# Altium project O_Flicker_V01_D0506.PrjPCB
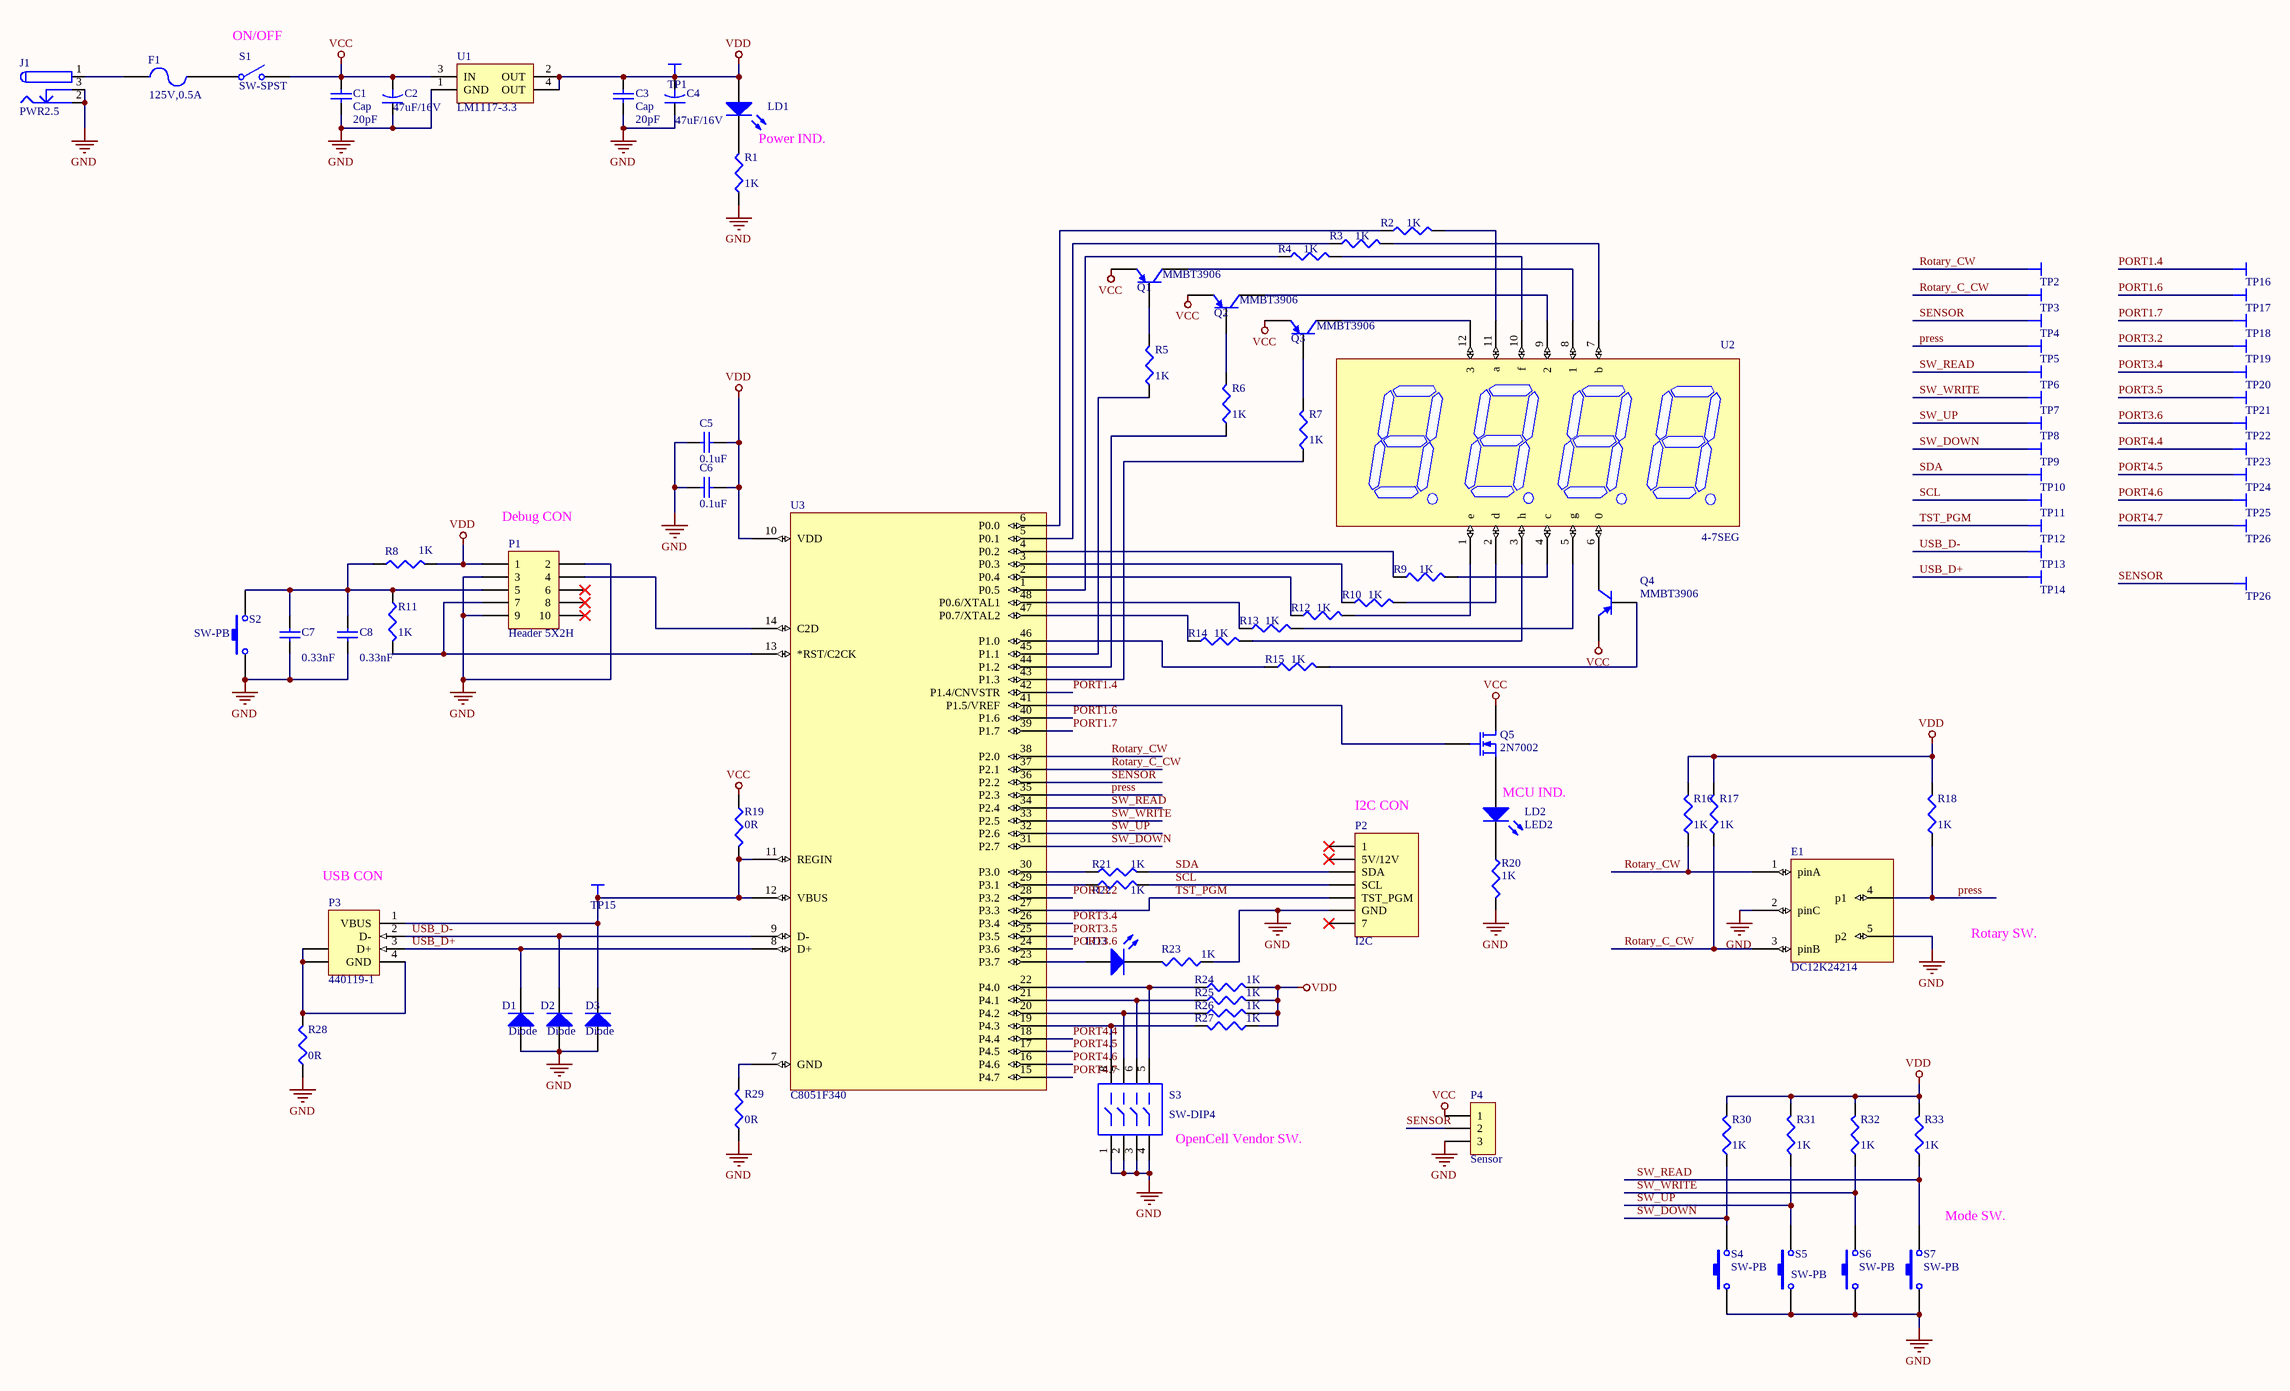
[diagram p0: Flicker_hardwareV01_D0506.SchDoc]
1 sheet, 96 parts. Net scope: global (net labels, ports and power ports of the same name join across sheets).
Board file: O_Flicker_V01_D0506.PcbDoc

## Sheet Flicker_hardwareV01_D0506.SchDoc
size A2

### Parts
(Parts that share a designator on the sheet are numbered #1, #2 ... from top to bottom, then left to right.)
C1  Cap  value 20pF  [C0805]
C2  47uF/16V  [CAP-5*2]
C3  Cap  value 20pF  [C0805]
C4  47uF/16V  [CAP-5*2]
C5  value 0.1uF  [C0603]  (hidden comment: Cap Semi)
C6  value 0.1uF  [C0603]  (hidden comment: Cap Semi)
C7  value 0.33nF  [C0603]  (hidden comment: Cap Semi)
C8  value 0.33nF  [C0603]  (hidden comment: Cap Semi)
D1  Diode  [DO-214AA]
D2  Diode  [DO-214AA]
D3  Diode  [DO-214AA]
E1  DC12K24214  [DC12K24214]
F1  Fuse 2  [F1206]  (value not drawn)
J1  value PWR2.5  [DC-JACK]  (hidden comment: DC JACK 3P/2mm)
LD1  LED2  [D0603]  (value not drawn)
LD2  LED2  [D0603]
LD3  LED2  [D0603]  (value not drawn)
P1  Header 5X2H  [HDR2X5]
P2  I2C  [CH7P\2.0-H]
P3  440119-1  [440119]
P4  Sensor  [CH3P\2.54-V]
Q1  MMBT3906  [SOT23_N]
Q2  MMBT3906  [SOT23_N]
Q3  MMBT3906  [SOT23_N]
Q4  MMBT3906  [SOT23_N]
Q5  2N7002  [SOT23_N]
R1  value 1K  [R0603]  (hidden comment: Res3)
R2  value 1K  [R0603]  (hidden comment: Res3)
R3  value 1K  [R0603]  (hidden comment: Res3)
R4  value 1K  [R0603]  (hidden comment: Res3)
R5  value 1K  [R0603]  (hidden comment: Res3)
R6  value 1K  [R0603]  (hidden comment: Res3)
R7  value 1K  [R0603]  (hidden comment: Res3)
R8  value 1K  [R0603]  (hidden comment: Res3)
R9  value 1K  [R0603]  (hidden comment: Res3)
R10  value 1K  [R0603]  (hidden comment: Res3)
R11  value 1K  [R0603]  (hidden comment: Res3)
R12  value 1K  [R0603]  (hidden comment: Res3)
R13  value 1K  [R0603]  (hidden comment: Res3)
R14  value 1K  [R0603]  (hidden comment: Res3)
R15  value 1K  [R0603]  (hidden comment: Res3)
R16  value 1K  [R0603]  (hidden comment: Res3)
R17  value 1K  [R0603]  (hidden comment: Res3)
R18  value 1K  [R0603]  (hidden comment: Res3)
R19  value 0R  [R0603]  (hidden comment: Res3)
R20  value 1K  [R0603]  (hidden comment: Res3)
R21  value 1K  [R0603]  (hidden comment: Res3)
R22  value 1K  [R0603]  (hidden comment: Res3)
R23  value 1K  [R0603]  (hidden comment: Res3)
R24  value 1K  [R0603]  (hidden comment: Res3)
R25  value 1K  [R0603]  (hidden comment: Res3)
R26  value 1K  [R0603]  (hidden comment: Res3)
R27  value 1K  [R0603]  (hidden comment: Res3)
R28  value 0R  [R0603]  (hidden comment: Res3)
R29  value 0R  [R0603]  (hidden comment: Res3)
R30  value 1K  [R0603]  (hidden comment: Res3)
R31  value 1K  [R0603]  (hidden comment: Res3)
R32  value 1K  [R0603]  (hidden comment: Res3)
R33  value 1K  [R0603]  (hidden comment: Res3)
S1  SW-SPST  [SW-2P]
S2  SW-PB  [SW-DIP4P-1]
S3  SW-DIP4  [SW-8P\11.52*9.9]
S4  SW-PB  [SW-DIP4P-1]
S5  SW-PB  [SW-DIP4P-1]
S6  SW-PB  [SW-DIP4P-1]
S7  SW-PB  [SW-DIP4P-1]
TP1  TP  [TP30]  (value not drawn)
TP2  TP  [TP30]  (value not drawn)
TP3  TP  [TP30]  (value not drawn)
TP4  TP  [TP30]  (value not drawn)
TP5  TP  [TP30]  (value not drawn)
TP6  TP  [TP30]  (value not drawn)
TP7  TP  [TP30]  (value not drawn)
TP8  TP  [TP30]  (value not drawn)
TP9  TP  [TP30]  (value not drawn)
TP10  TP  [TP30]  (value not drawn)
TP11  TP  [TP30]  (value not drawn)
TP12  TP  [TP30]  (value not drawn)
TP13  TP  [TP30]  (value not drawn)
TP14  TP  [TP30]  (value not drawn)
TP15  TP  [TP30]  (value not drawn)
TP16  TP  [TP1]  (value not drawn)
TP17  TP  [TP1]  (value not drawn)
TP18  TP  [TP1]  (value not drawn)
TP19  TP  [TP1]  (value not drawn)
TP20  TP  [TP1]  (value not drawn)
TP21  TP  [TP1]  (value not drawn)
TP22  TP  [TP1]  (value not drawn)
TP23  TP  [TP1]  (value not drawn)
TP24  TP  [TP1]  (value not drawn)
TP25  TP  [TP1]  (value not drawn)
TP26#1  TP  [TP1]  (value not drawn)
TP26#2  TP  [TP1]  (value not drawn)
U1  LM1117-3.3  [ZZ311]
U2  4-7SEG
U3  C8051F340  [TQFP-48]

### Nets
GND: C1.1 C2.1 C3.1 C4.1 C5.2 C6.2 C7.1 C8.1 D1.1(A) D2.1(A) D3.1(A) E1.2(pinC) E1.5(p2) J1.2 J1.3 P1.2 P1.3 P1.9 P2.6(GND) P4.3 R1.1 R20.2 R23.1 R28.1 R29.1 S2.2 S3.1 S3.2 S3.3 S3.4 S4.1 S5.1 S6.1 S7.1 U1.1(GND)
VCC: C1.2 C2.2 P4.1 Q1.2(E) Q2.2(E) Q3.2(E) Q4.2(E) Q5.1(D) R19.1 S1.2(NO) U1.3(IN)
VDD: C3.2 C4.2 C5.1 C6.1 LD1.1(A) P1.1 R8.2 R16.2 R17.2 R18.2 R24.2 R25.2 R26.2 R27.1 R30.2 R31.2 R32.2 R33.2 TP1.1(TP?) U1.2(OUT) U1.4(OUT) U3.10(VDD)
PORT1.4: TP16.1(TP?) U3.42(P1.4/CNVSTR)
PORT1.6: TP17.1(TP?) U3.40(P1.6)
PORT1.7: TP18.1(TP?) U3.39(P1.7)
PORT3.2: TP19.1(TP?) U3.28(P3.2)
PORT3.4: TP20.1(TP?) U3.26(P3.4)
PORT3.5: TP21.1(TP?) U3.25(P3.5)
PORT3.6: TP22.1(TP?) U3.24(P3.6)
PORT4.4: TP23.1(TP?) U3.18(P4.4)
PORT4.5: TP24.1(TP?) U3.17(P4.5)
PORT4.6: TP25.1(TP?) U3.16(P4.6)
PORT4.7: TP26#1.1(TP?) U3.15(P4.7)
press: E1.4(p1) R18.1 TP5.1(TP?) U3.35(P2.3)
Rotary_C_CW: E1.3(pinB) R17.1 TP3.1(TP?) U3.37(P2.1)
Rotary_CW: E1.1(pinA) R16.1 TP2.1(TP?) U3.38(P2.0)
SCL: P2.4(SCL) R22.2 TP11.1(TP?)
SDA: P2.3(SDA) R21.2 TP10.1(TP?)
SENSOR: P4.2 TP4.1(TP?) TP26#2.1(TP?) U3.36(P2.2)
SW_DOWN: R30.1 S4.2 TP9.1(TP?) U3.31(P2.7)
SW_READ: R33.1 S7.2 TP6.1(TP?) U3.34(P2.4)
SW_UP: R31.1 S5.2 TP8.1(TP?) U3.32(P2.6)
SW_WRITE: R32.1 S6.2 TP7.1(TP?) U3.33(P2.5)
TST_PGM: P2.5(TST_PGM) TP12.1(TP?) U3.27(P3.3)
USB_D+: D1.2(K) P3.3(D+) TP14.1(TP?) U3.8(D+)
USB_D-: D2.2(K) P3.2(D-) TP13.1(TP?) U3.9(D-)
NetC7_2: C7.2 C8.2 P1.5 R8.1 R11.1 S2.1
NetD3_2: D3.2(K) P3.1(VBUS) R19.2 TP15.1(TP?) U3.11(REGIN) U3.12(VBUS)
NetF1_1: F1.1 J1.1
NetF1_2: F1.2 S1.1(COMMON)
NetLD1_2: LD1.2(K) R1.2
NetLD2_1: LD2.1(A) Q5.2(S)
NetLD2_2: LD2.2(K) R20.1
NetLD3_1: LD3.1(A) U3.23(P3.7)
NetLD3_2: LD3.2(K) R23.2
NetP1_4: P1.4 U3.14(C2D)
NetP1_7: P1.7 R11.2 U3.13(*RST/C2CK)
NetP3_4: P3.4(GND) P3.5(SHLD) P3.6(SHLD) R28.2
NetQ1_1: Q1.1(B) R5.2
NetQ1_3: Q1.3(C) U2.8(1)
NetQ2_1: Q2.1(B) R6.2
NetQ2_3: Q2.3(C) U2.9(2)
NetQ3_1: Q3.1(B) R7.2
NetQ3_3: Q3.3(C) U2.12(3)
NetQ4_1: Q4.1(B) R15.2
NetQ4_3: Q4.3(C) U2.6(0)
NetQ5_3: Q5.3(G) U3.41(P1.5/VREF)
NetR2_1: R2.1 U3.6(P0.0)
NetR2_2: R2.2 U2.11(a)
NetR3_1: R3.1 U3.5(P0.1)
NetR3_2: R3.2 U2.7(b)
NetR4_1: R4.1 U3.1(P0.5)
NetR4_2: R4.2 U2.10(f)
NetR5_1: R5.1 U3.45(P1.1)
NetR6_1: R6.1 U3.44(P1.2)
NetR7_1: R7.1 U3.43(P1.3)
NetR9_1: R9.1 U3.4(P0.2)
NetR9_2: R9.2 U2.4(c)
NetR10_1: R10.1 U3.3(P0.3)
NetR10_2: R10.2 U2.2(d)
NetR12_1: R12.1 U3.2(P0.4)
NetR12_2: R12.2 U2.1(e)
NetR13_1: R13.1 U3.48(P0.6/XTAL1)
NetR13_2: R13.2 U2.5(g)
NetR14_1: R14.1 U3.47(P0.7/XTAL2)
NetR14_2: R14.2 U2.3(h)
NetR15_1: R15.1 U3.46(P1.0)
NetR21_1: R21.1 U3.30(P3.0)
NetR22_1: R22.1 U3.29(P3.1)
NetR24_1: R24.1 S3.5 U3.22(P4.0)
NetR25_1: R25.1 S3.6 U3.21(P4.1)
NetR26_1: R26.1 S3.7 U3.20(P4.2)
NetR27_2: R27.2 S3.8 U3.19(P4.3)
NetR29_2: R29.2 U3.7(GND)

Not connected (* = marked no-connect by the designer): P1 6* 8* 10*; P2 1* 2(5V/12V)* 7*

### Notes on the sheet
- (near S1) ON/OFF
- Power IND.
- (near P1) Debug CON
- (near P2) I2C CON
- (near LD2) MCU IND.
- (near P3) USB CON
- Rotary SW.
- (near S3) OpenCell Vendor SW.
- (near S7) Mode SW.
- (in symbol Fuse 2) 125V,0.5A

### Library data of the parts
C1 C3 = Cap: Capacitor; Published: 8-Jun-2000; LatestRevisionDate: 17-Jul-2002; LatestRevisionNote: Re-released for DXP Platform.; PackageReference: RAD-0.3; Publisher: Altium Limited
C2 C4 = Cap2: Capacitor; Value: 100pF; Published: 23-Sep-2002; PackageReference: CAPR5-4X5; Publisher: Altium Limited
C5-C8 = Cap Semi: Capacitor (Semiconductor SIM Model); Published: 8-Jun-2000; LatestRevisionDate: 29-May-2009; LatestRevisionNote: IPC-7351 Footprint Added.; PackageReference: C1206; Publisher: Altium Limited; PackageDescription: Chip Capacitor
D1-D3 = Diode: Default Diode; Published: 8-Jun-2000; LatestRevisionDate: 17-Jul-2002; LatestRevisionNote: Re-released for DXP Platform.; PackageVersion: Sep-1996; PackageReference: SMC; Publisher: Altium Limited; Code_JEDEC: DO-214-AB
E1 = DC12K24214: Rotary Encoder+Push Button
F1 = Fuse 2: Fuse; Published: 8-Jun-2000; LatestRevisionDate: 17-Jul-2002; LatestRevisionNote: Re-released for DXP Platform.; PackageReference: PIN-W2/E2.8; Publisher: Altium Limited
J1 = PWR2.5: Published: 17-Dec-2003; DatasheetDocument: 09-May-2002; Publisher: Altium Limited; ComponentLink1Description: Manufacturer Link; ComponentLink1URL: http://domino.kycon.com/internet/Products.html
LD1-LD3 = LED2: Typical RED, GREEN, YELLOW, AMBER GaAs LED; Published: 8-Jun-2000; LatestRevisionDate: 17-Jul-2002; LatestRevisionNote: Re-released for DXP Platform.; PackageVersion: Feb-2002; PackageReference: 3.2X1.6X1.1; Publisher: Altium Limited
P1 = Header 5X2H: Header, 5-Pin, Dual row, Right Angle; LatestRevisionDate: 17-Jul-2002; LatestRevisionNote: Re-released for DXP Platform.; Publisher: Altium Limited
P2 = S7B-PH-K-S: Header, 7-Pin, Right Angle; LatestRevisionDate: 17-Jul-2002; LatestRevisionNote: Re-released for DXP Platform.; Publisher: Altium Limited
P3 = 440119-1: USB 1.1, Right Angle, Thru-Hole, B Type, Receptacle, 4 Position, Beige; ContactMaterial: Copper Alloy; ContactPlating: Gold Flash over Nickel; TerminationLength: 2.84mm [0.112in.]; PCB_Layout: Complies with manufacturer's recommendation.; DrillSize: Corresponds to nominal value.; PanelGround: Without; Published: 15-Jul-2004; DatasheetDocument: 12-Jan-2004; PackageDocument: 12-Jan-2004; PackageReference: 440119; Publisher: Altium Limited; HousingMaterial: Thermoplastic; ComponentLink1Description: Manufacturer Link; ComponentLink1URL: http://www.tycoelectronics.com/; ComponentLink2Description: Packaging Specification; ComponentLink2URL: http://ecommas.tycoelectronics.com/commerce/DocumentDelivery/DDEController?Action=showdoc&DocId=Customer+Drawing%7F440119%7FC%7Ftif%7FEnglish%7FC_440119_C.tif
P4 = S3B-PH-K-S: Header, 7-Pin, Right Angle; LatestRevisionDate: 17-Jul-2002; LatestRevisionNote: Re-released for DXP Platform.; Publisher: Altium Limited
Q1-Q4 = MMBT3906: PNP Switching Transistor; Published: 17-Sep-2003; LatestRevisionDate: 12-Dec-2006; LatestRevisionNote: IPC-7351 Footprint Added.; DatasheetVersion: 11-Apr-2000; PackageVersion: May-1999; PackageReference: SOT23; Publisher: Altium Limited; PackageDescription: 3-Pin SOT-23 Package 0.95 mm Pitch, 2.3 mm Lead Span; ComponentLink1Description: Manufacturer Link; ComponentLink1URL: http://www.semiconductors.philips.com/; ComponentLink2Description: Datasheet; ComponentLink2URL: http://www.semiconductors.philips.com/acrobat/datasheets/MMBT3906_2.pdf
Q5 = 2N7002: N-Channel Enhancement Mode Vertical DMOS FET; Published: 8-Jun-2000; LatestRevisionDate: 17-Jul-2002; LatestRevisionNote: Re-released for DXP Platform.; DatasheetVersion: Jan-1996; PackageVersion: 1996; PackageReference: SOT23; Publisher: Altium Limited; PackageDescription: SOT-23; 3 Leads; Body 3.1 x 2.5 mm, inc. leads (LxW max), Alternate Lead Configuration; ComponentLink1Description: Manufacturer Link; ComponentLink1URL: http://www.zetex.com/
R1-R33 = Res3: Resistor; Published: 8-Jun-2000; LatestRevisionDate: 29-May-2009; LatestRevisionNote: IPC-7351 Footprint Added.; PackageReference: J1-0603; Publisher: Altium Limited; PackageDescription: Chip Resistor
S1 = SW-SPST: Single-Pole, Single-Throw Switch; Published: 24-Mar-1999; LatestRevisionDate: 17-Jul-2002; LatestRevisionNote: Re-released for DXP Platform.; PackageReference: SPST-2; Publisher: Altium Limited
S2 S4-S7 = SW-PB: Switch; Published: 24-Mar-1999; LatestRevisionDate: 17-Jul-2002; LatestRevisionNote: Re-released for DXP Platform.; PackageReference: SPST-2; Publisher: Altium Limited
S3 = SW-DIP4: DIP Switch; Published: 24-Mar-1999; LatestRevisionDate: 17-Jul-2002; LatestRevisionNote: Re-released for DXP Platform.; PackageReference: DIP-8; Publisher: Altium Limited
U1 = LM1117-3.3: 800mA and 1A Low Dropout Positive Regulator 2.85V, 3.3V, 5V, and Adjustable; Published: 8-Jun-2000; LatestRevisionDate: 17-Jul-2002; LatestRevisionNote: Re-released for DXP Platform.; DatasheetVersion: Sep-1997; PackageVersion: revC; PackageReference: ZZ311; Publisher: Altium Limited; PackageDescription: SOT-223/SC-73; 4 Leads; Body 6.7 x 7.3 mm, inc. leads (LxW max); ComponentLink1Description: Manufacturer Link; ComponentLink1URL: http://www.ti.com/; ComponentLink2Description: Datasheet; ComponentLink2URL: http://www-s.ti.com/sc/ds/REG1117.pdf
U2 = 7-SEG LED Display: ¥|¦ì¤C¬qÅã¥Ü¾¹
U3 = C8051F340: Silicon Lab - Full Speed USB Flash MCU